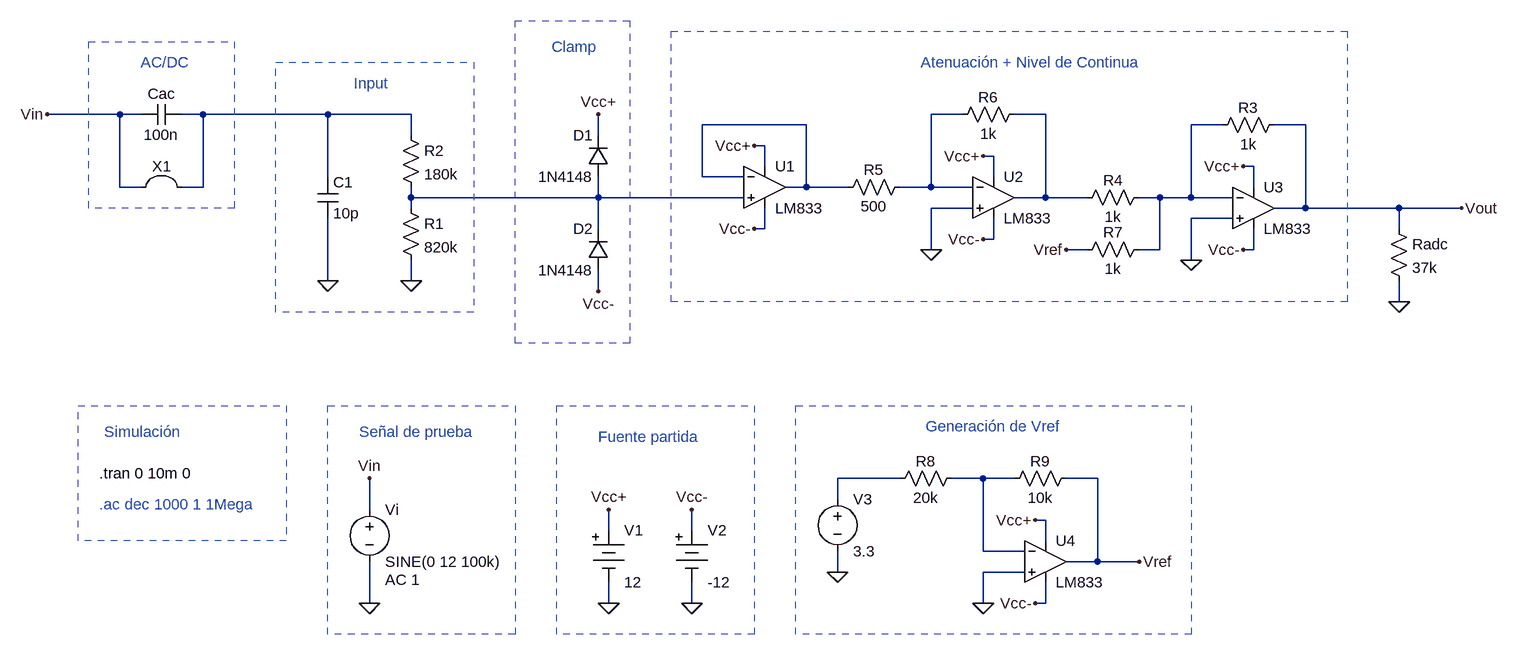
[diagram p0: schematic Etapa de Entrada v2.asc]
Etapa de Entrada v2.asc, the LTspice schematic file:
Version 4
SHEET 1 2568 844
WIRE 96 32 -16 32
WIRE 128 32 96 32
WIRE 224 32 192 32
WIRE 416 32 224 32
WIRE 544 32 416 32
WIRE 1392 32 1344 32
WIRE 1520 32 1472 32
WIRE 1152 48 992 48
WIRE 1792 48 1744 48
WIRE 1920 48 1872 48
WIRE 544 64 544 32
WIRE 832 64 832 32
WIRE 1088 80 1072 80
WIRE 1440 96 1424 96
WIRE 1088 112 1088 80
WIRE 1840 112 1824 112
WIRE 416 128 416 32
WIRE 992 128 992 48
WIRE 1056 128 992 128
WIRE 1440 128 1440 96
WIRE 96 144 96 32
WIRE 128 144 96 144
WIRE 224 144 224 32
WIRE 224 144 192 144
WIRE 1152 144 1152 48
WIRE 1152 144 1120 144
WIRE 1216 144 1152 144
WIRE 1344 144 1344 32
WIRE 1344 144 1296 144
WIRE 1408 144 1344 144
WIRE 1840 144 1840 112
WIRE 544 160 544 144
WIRE 832 160 832 128
WIRE 832 160 544 160
WIRE 1056 160 832 160
WIRE 1520 160 1520 32
WIRE 1520 160 1472 160
WIRE 1584 160 1520 160
WIRE 1696 160 1664 160
WIRE 1744 160 1744 48
WIRE 1744 160 1696 160
WIRE 1808 160 1744 160
WIRE 544 176 544 160
WIRE 1408 176 1344 176
WIRE 1920 176 1920 48
WIRE 1920 176 1872 176
WIRE 2064 176 1920 176
WIRE 2160 176 2064 176
WIRE 1808 192 1744 192
WIRE 832 208 832 160
WIRE 1088 208 1088 176
WIRE 1088 208 1072 208
WIRE 2064 208 2064 176
WIRE 1440 224 1440 192
WIRE 1440 224 1424 224
WIRE 1344 240 1344 176
WIRE 1584 240 1552 240
WIRE 1696 240 1696 160
WIRE 1696 240 1664 240
WIRE 1840 240 1840 208
WIRE 1840 240 1824 240
WIRE 1744 256 1744 192
WIRE 416 288 416 192
WIRE 544 288 544 256
WIRE 832 304 832 272
WIRE 2064 320 2064 288
WIRE 1296 592 1200 592
WIRE 1424 592 1376 592
WIRE 1472 592 1424 592
WIRE 1600 592 1552 592
WIRE 1200 624 1200 592
WIRE 480 640 480 592
WIRE 1520 656 1504 656
WIRE 848 672 848 640
WIRE 976 672 976 640
WIRE 1520 688 1520 656
WIRE 1424 704 1424 592
WIRE 1488 704 1424 704
WIRE 1600 720 1600 592
WIRE 1600 720 1552 720
WIRE 1664 720 1600 720
WIRE 1200 736 1200 704
WIRE 1488 736 1424 736
WIRE 480 784 480 720
WIRE 848 784 848 752
WIRE 976 784 976 752
WIRE 1424 784 1424 736
WIRE 1520 784 1520 752
WIRE 1520 784 1504 784
FLAG -16 32 Vin
FLAG 480 592 Vin
FLAG 480 784 0
FLAG 2160 176 Vout
FLAG 544 288 0
FLAG 416 288 0
FLAG 848 640 Vcc+
FLAG 976 640 Vcc-
FLAG 976 784 0
FLAG 848 784 0
FLAG 832 32 Vcc+
FLAG 832 304 Vcc-
FLAG 1344 240 0
FLAG 1072 80 Vcc+
FLAG 1072 208 Vcc-
FLAG 1552 240 Vref
FLAG 1200 736 0
FLAG 1424 784 0
FLAG 1504 656 Vcc+
FLAG 1504 784 Vcc-
FLAG 2064 320 0
FLAG 1424 96 Vcc+
FLAG 1424 224 Vcc-
FLAG 1744 256 0
FLAG 1824 112 Vcc+
FLAG 1824 240 Vcc-
FLAG 1664 720 Vref
SYMBOL voltage 480 624 R0
WINDOW 123 24 124 Left 2
WINDOW 39 0 0 Left 0
SYMATTR Value2 AC 1
SYMATTR InstName Vi
SYMATTR Value SINE(0 12 100k)
SYMBOL cap 192 16 R90
WINDOW 0 0 32 VBottom 2
WINDOW 3 32 32 VTop 2
SYMATTR InstName Cac
SYMATTR Value 100n
SYMBOL Misc\\jumper 160 80 R0
SYMATTR InstName X1
SYMBOL cap 400 128 R0
SYMATTR InstName C1
SYMATTR Value 10p
SYMBOL res 528 48 R0
SYMATTR InstName R2
SYMATTR Value 180k
SYMBOL res 528 160 R0
SYMATTR InstName R1
SYMATTR Value 820k
SYMBOL diode 848 128 R180
WINDOW 0 24 64 Left 2
WINDOW 3 24 0 Left 2
SYMATTR InstName D1
SYMATTR Value 1N4148
SYMBOL diode 848 272 R180
WINDOW 0 24 64 Left 2
WINDOW 3 24 0 Left 2
SYMATTR InstName D2
SYMATTR Value 1N4148
SYMBOL Misc\\battery 848 656 R0
WINDOW 123 0 0 Left 0
WINDOW 39 0 0 Left 0
SYMATTR InstName V1
SYMATTR Value 12
SYMBOL Misc\\battery 976 656 R0
WINDOW 123 0 0 Left 0
WINDOW 39 0 0 Left 0
SYMATTR InstName V2
SYMATTR Value -12
SYMBOL res 1200 160 R270
WINDOW 0 27 56 VTop 2
WINDOW 3 2 56 VBottom 2
SYMATTR InstName R5
SYMATTR Value 500
SYMBOL res 1376 48 R270
WINDOW 0 27 56 VTop 2
WINDOW 3 2 56 VBottom 2
SYMATTR InstName R6
SYMATTR Value 1k
SYMBOL res 1568 256 R270
WINDOW 0 27 56 VTop 2
WINDOW 3 2 56 VBottom 2
SYMATTR InstName R7
SYMATTR Value 1k
SYMBOL voltage 1200 608 R0
WINDOW 123 0 0 Left 0
WINDOW 39 0 0 Left 0
SYMATTR InstName V3
SYMATTR Value 3.3
SYMBOL res 1280 608 R270
WINDOW 0 27 56 VTop 2
WINDOW 3 2 56 VBottom 2
SYMATTR InstName R8
SYMATTR Value 20k
SYMBOL res 1456 608 R270
WINDOW 0 27 56 VTop 2
WINDOW 3 2 56 VBottom 2
SYMATTR InstName R9
SYMATTR Value 10k
SYMBOL res 2048 192 R0
SYMATTR InstName Radc
SYMATTR Value 37k
SYMBOL res 1776 64 R270
WINDOW 0 27 56 VTop 2
WINDOW 3 2 56 VBottom 2
SYMATTR InstName R3
SYMATTR Value 1k
SYMBOL res 1568 176 R270
WINDOW 0 27 56 VTop 2
WINDOW 3 2 56 VBottom 2
SYMATTR InstName R4
SYMATTR Value 1k
SYMBOL TCLib\\LM833 1440 160 R0
SYMATTR InstName U2
SYMBOL TCLib\\LM833 1840 176 R0
SYMATTR InstName U3
SYMBOL TCLib\\LM833 1520 720 R0
SYMATTR InstName U4
SYMBOL TCLib\\LM833 1088 144 R0
SYMATTR InstName U1
TEXT 64 584 Left 2 !.tran 0 10m 0
TEXT 64 632 Left 2 ;.ac dec 1000 1 1Mega
TEXT 760 -72 Left 2 ;Clamp
TEXT 128 -48 Left 2 ;AC/DC
TEXT 456 -16 Left 2 ;Input
TEXT 1328 -48 Left 2 ;Atenuación + Nivel de Continua
TEXT 1336 512 Left 2 ;Generación de Vref
TEXT 832 528 Left 2 ;Fuente partida
TEXT 464 520 Left 2 ;Señal de prueba
TEXT 72 520 Left 2 ;Simulación
RECTANGLE Normal 880 384 704 -112 3
RECTANGLE Normal 272 176 48 -80 3
RECTANGLE Normal 640 336 336 -48 3
RECTANGLE Normal 1984 320 944 -96 3
RECTANGLE Normal 1744 832 1136 480 3
RECTANGLE Normal 1072 832 768 480 3
RECTANGLE Normal 704 832 416 480 3
RECTANGLE Normal 352 688 32 480 3

The netlist it stands for:
* Etapa de Entrada v2.asc
Vi Vin 0 SINE(0 12 100k) AC 1
Cac Vin Vin 100n
C1 Vin 0 10p
R2 Vin N005 180k
R1 N005 0 820k
D1 N005 Vcc+ 1N4148
D2 Vcc- N005 1N4148
V1 Vcc+ 0 12
V2 Vcc- 0 -12
R5 N003 N001 500
R6 N001 N002 1k
R7 Vref N004 1k
V3 N006 0 3.3
R8 N006 N007 20k
R9 N007 Vref 10k
Radc Vout 0 37k
R3 N004 Vout 1k
R4 N002 N004 1k
* U2: LM833 (symbol TCLib\LM833 not available, pins judged from their places): In+=0 In-=N001 V+=Vcc+ V-=Vcc- OUT=N002
* U3: LM833 (symbol TCLib\LM833 not available, pins judged from their places): In+=0 In-=N004 V+=Vcc+ V-=Vcc- OUT=Vout
* U4: LM833 (symbol TCLib\LM833 not available, pins judged from their places): In+=0 In-=N007 V+=Vcc+ V-=Vcc- OUT=Vref
* U1: LM833 (symbol TCLib\LM833 not available, pins judged from their places): In+=N005 In-=N003 V+=Vcc+ V-=Vcc- OUT=N003
.model D D
.lib standard.dio
.tran 0 10m 0
* .ac dec 1000 1 1Mega
* Clamp
* AC/DC
* Input
* Atenuación + Nivel de Continua
* Generación de Vref
* Fuente partida
* Señal de prueba
* Simulación
.backanno
.end